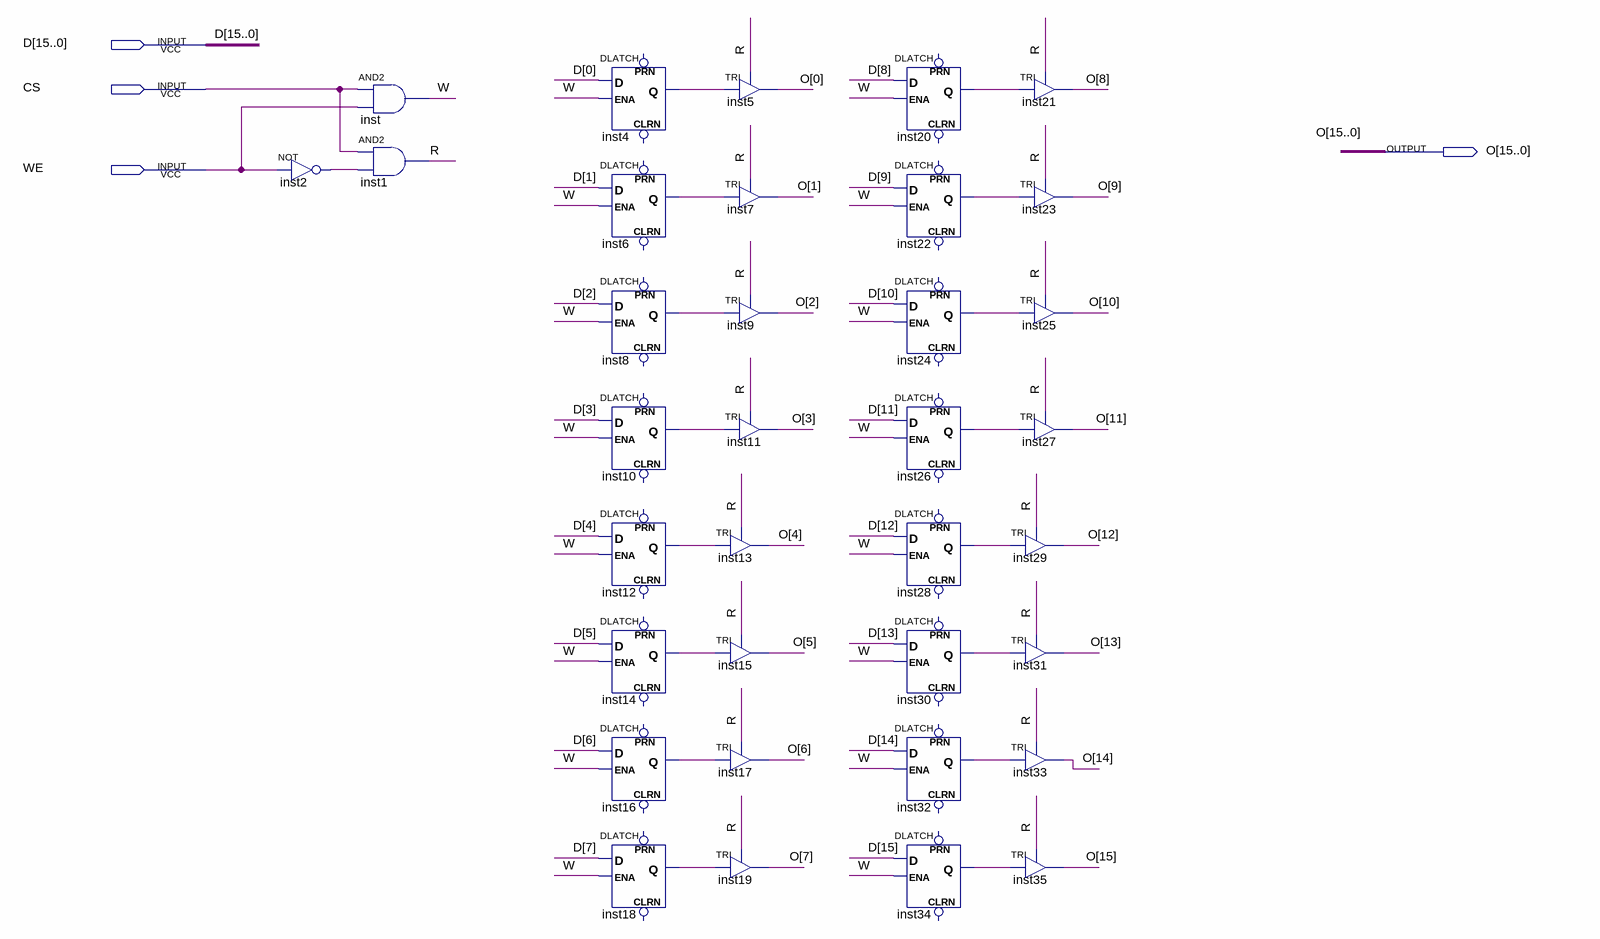
[diagram p0: schematic sheet]
// Quartus schematic WORD16BIT.bdf as structural Verilog: 35 symbols, 4 pins
module WORD16BIT (
  input  [15:0] D,
  input  CS,
  input  WE,
  output [15:0] O
);

  wire inst2_out, inst4_q, inst6_q, inst8_q, inst10_q, inst12_q, inst14_q, inst16_q, inst18_q, inst20_q,
       inst22_q, inst24_q, inst26_q, inst28_q, inst30_q, inst32_q, inst34_q, R, W;

  not inst2 (inst2_out, WE);
  and inst (W, CS, WE);
  and inst1 (R, CS, inst2_out);
  DLATCH inst4 (.D(D[0]), .ENA(W), .Q(inst4_q));  // open: CLRN, PRN
  DLATCH inst6 (.D(D[1]), .ENA(W), .Q(inst6_q));  // open: CLRN, PRN
  DLATCH inst8 (.D(D[2]), .ENA(W), .Q(inst8_q));  // open: CLRN, PRN
  DLATCH inst10 (.D(D[3]), .ENA(W), .Q(inst10_q));  // open: CLRN, PRN
  DLATCH inst12 (.D(D[4]), .ENA(W), .Q(inst12_q));  // open: CLRN, PRN
  DLATCH inst14 (.D(D[5]), .ENA(W), .Q(inst14_q));  // open: CLRN, PRN
  DLATCH inst16 (.D(D[6]), .ENA(W), .Q(inst16_q));  // open: CLRN, PRN
  DLATCH inst18 (.D(D[7]), .ENA(W), .Q(inst18_q));  // open: CLRN, PRN
  TRI inst5 (.IN(inst4_q), .OE(R), .OUT(O[0]));
  TRI inst7 (.IN(inst6_q), .OE(R), .OUT(O[1]));
  TRI inst9 (.IN(inst8_q), .OE(R), .OUT(O[2]));
  TRI inst11 (.IN(inst10_q), .OE(R), .OUT(O[3]));
  TRI inst13 (.IN(inst12_q), .OE(R), .OUT(O[4]));
  TRI inst15 (.IN(inst14_q), .OE(R), .OUT(O[5]));
  TRI inst17 (.IN(inst16_q), .OE(R), .OUT(O[6]));
  TRI inst19 (.IN(inst18_q), .OE(R), .OUT(O[7]));
  DLATCH inst20 (.D(D[8]), .ENA(W), .Q(inst20_q));  // open: CLRN, PRN
  DLATCH inst22 (.D(D[9]), .ENA(W), .Q(inst22_q));  // open: CLRN, PRN
  DLATCH inst24 (.D(D[10]), .ENA(W), .Q(inst24_q));  // open: CLRN, PRN
  DLATCH inst26 (.D(D[11]), .ENA(W), .Q(inst26_q));  // open: CLRN, PRN
  DLATCH inst28 (.D(D[12]), .ENA(W), .Q(inst28_q));  // open: CLRN, PRN
  DLATCH inst30 (.D(D[13]), .ENA(W), .Q(inst30_q));  // open: CLRN, PRN
  DLATCH inst32 (.D(D[14]), .ENA(W), .Q(inst32_q));  // open: CLRN, PRN
  DLATCH inst34 (.D(D[15]), .ENA(W), .Q(inst34_q));  // open: CLRN, PRN
  TRI inst29 (.IN(inst28_q), .OE(R), .OUT(O[12]));
  TRI inst31 (.IN(inst30_q), .OE(R), .OUT(O[13]));
  TRI inst33 (.IN(inst32_q), .OE(R), .OUT(O[14]));
  TRI inst35 (.IN(inst34_q), .OE(R), .OUT(O[15]));
  TRI inst21 (.IN(inst20_q), .OE(R), .OUT(O[8]));
  TRI inst23 (.IN(inst22_q), .OE(R), .OUT(O[9]));
  TRI inst25 (.IN(inst24_q), .OE(R), .OUT(O[10]));
  TRI inst27 (.IN(inst26_q), .OE(R), .OUT(O[11]));
endmodule
